# Altium schematic sheet Diagrama_digital.SchDoc
size A4
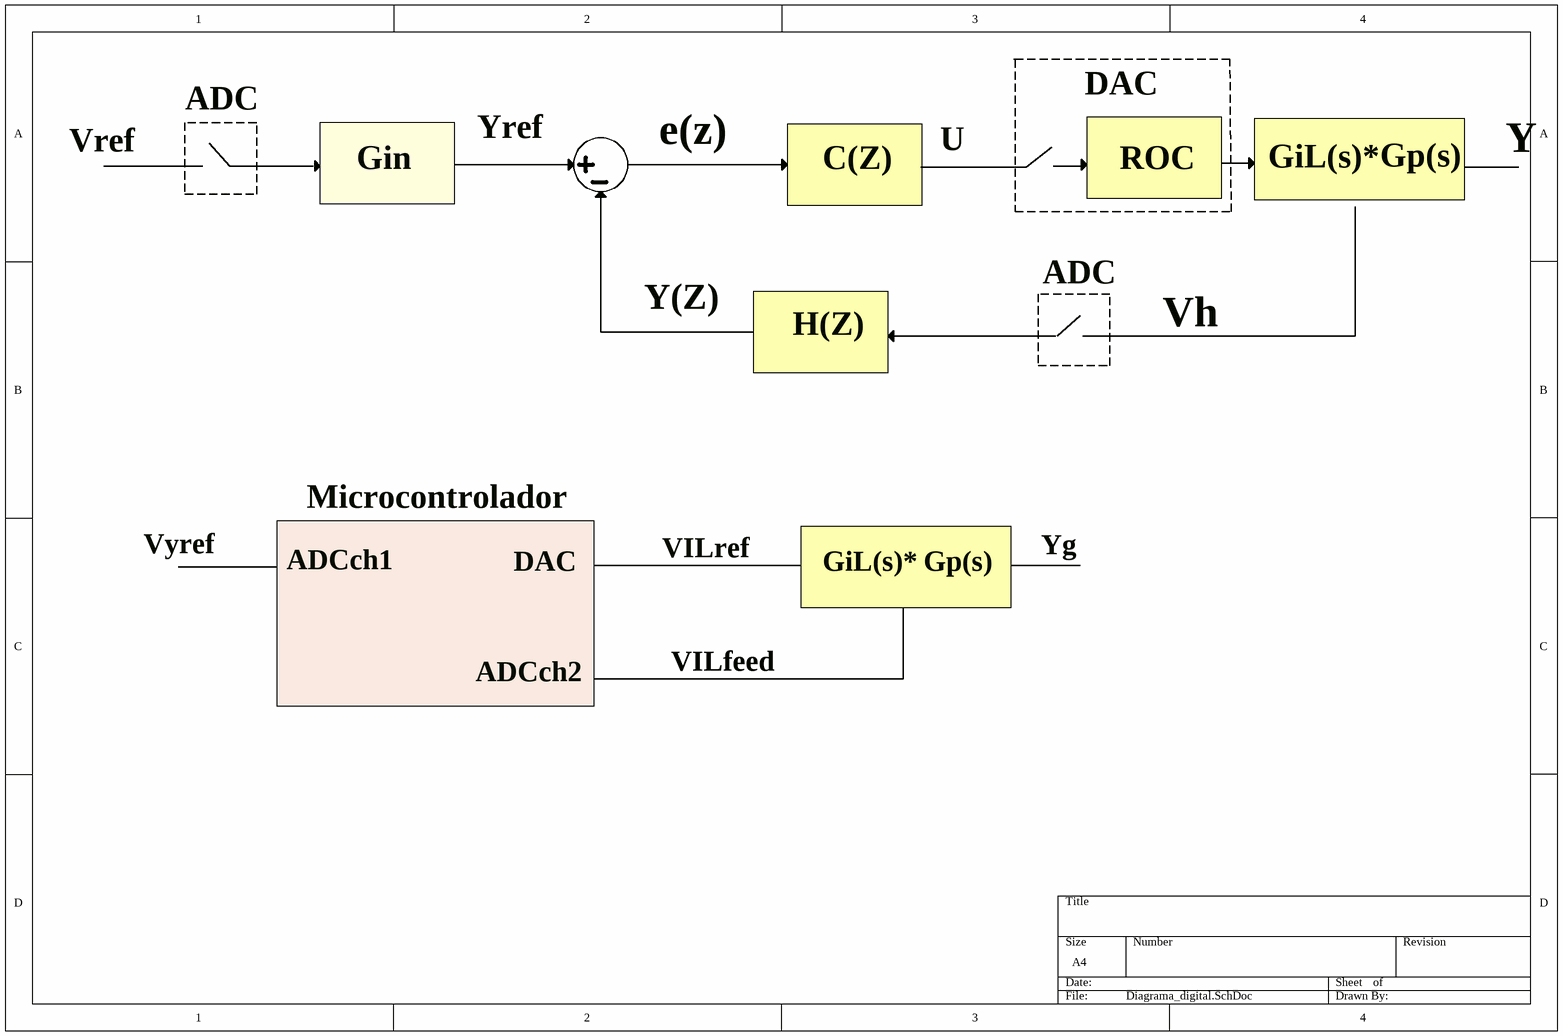
[diagram p0: Diagrama_digital.SchDoc]

## Notes on the sheet
- ADC
- DAC
- Vref
- Gin
- Yref
- e(z)
- C(Z)
- U
- ROC
- GiL(s)*
- Gp(s)
- Y
- Y(Z)
- H(Z)
- Vh
- Microcontrolador
- Vyref
- ADCch1
- VILref
- Yg
- ADCch2
- VILfeed